# EAGLE design microNode (EAGLE 9.1.2)
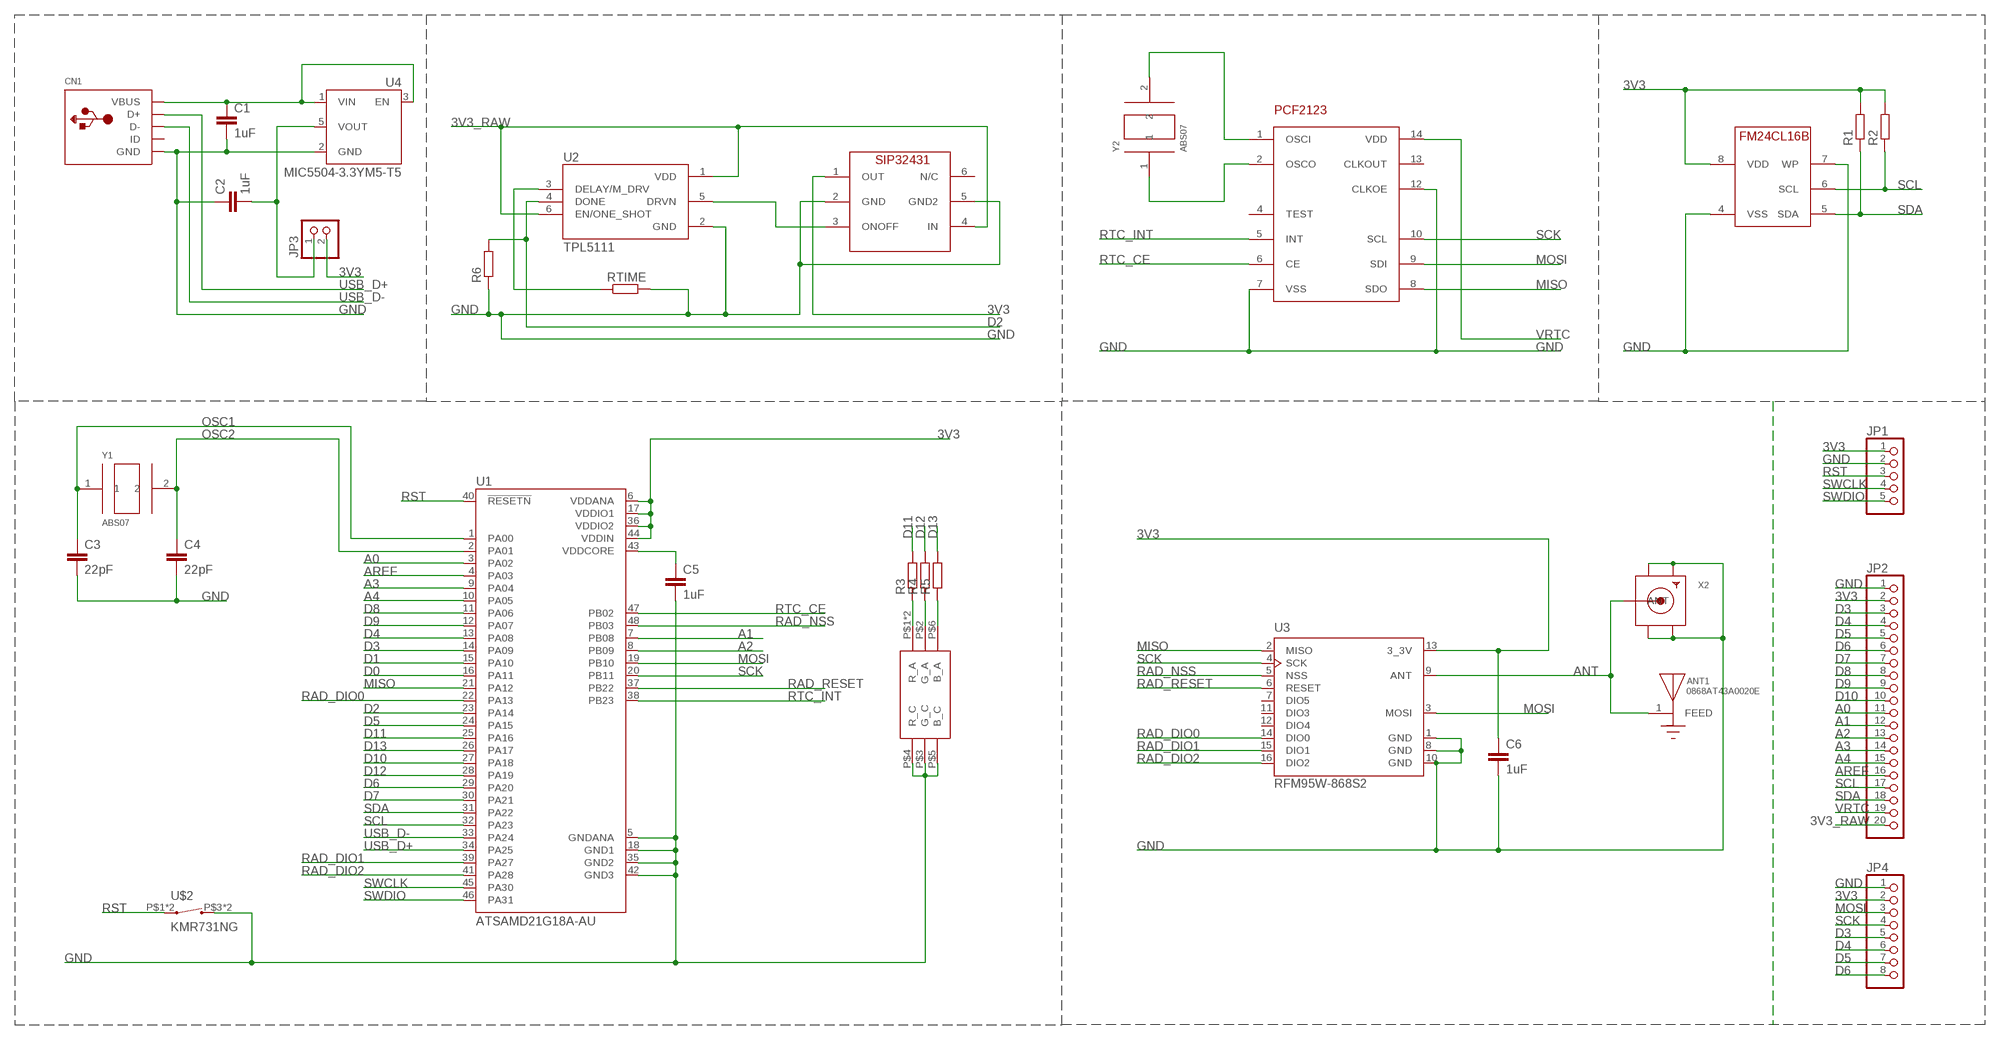
[diagram p0: schematic, sheet 1]

## Parts
ANT1  0868AT43A0020E  [XCVR_0868AT43A0020E]
C1  1uF  CC1206  [C1206]
C2  1uF  CC1206  [C1206]
C3  22pF  CC0603  [C0603]
C4  22pF  CC0603  [C0603]
C5  1uF  CC1206  [C1206]
C6  1uF  CC1206  [C1206]
CN1  USBMINIB  [USB-MINIB]
JP1  PINHD-1X5  [1X05]
JP2  PINHD-1X20  [1X20]
JP3  PINHD-1X2  [1X02]
JP4  PINHD-1X8  [1X08]
R1  RR0603  [R0603]
R2  RR0603  [R0603]
R3  RR0603  [R0603]
R4  RR0603  [R0603]
R5  RR0603  [R0603]
R6  RR0603  [R0603]
RTIME  RR1206  [R1206]
U1  ATSAMD21G18A-AU  [QFP50P900X900X120-48N]
U2  TPL5111  [SOT95P280X110-6N]
U3  RFM95W-868S2  [XCVR_RFM95W-868S2]
U4  MIC5504-3.3YM5-T5  [SOT23-5P95_280X145XL45X37N]
U5  FM24CL16B  [SOIC-8]
U7  SIP32431DR3  [SC-70-6]
U8  PCF2123  [TSSOP14]
U$1  MSL0104RGB  [MSL0104RGB]
U$2  KMR731NG  [KMR731NG]
X2  SMACONNECTOR  [SMA90_DIP]
Y1  ABS07  [XTAL320X150X90]
Y2  ABS07  [XTAL320X150X90]

## Nets
3V3: C6.1 JP1.1 JP2.2 JP3.2 JP4.2 R1.2 R2.2 U1.6(VDDANA) U1.17(VDDIO1) U1.36(VDDIO2) U1.44(VDDIN) U3.13(3_3V) U5.8(VDD) U7.1(OUT)
3V3_RAW: JP2.20 U2.1(VDD) U2.6(EN/ONE_SHOT) U7.4(IN)
A0: JP2.11 U1.3(PA02)
A1: JP2.12 U1.7(PB08)
A2: JP2.13 U1.8(PB09)
A3: JP2.14 U1.9(PA04)
A4: JP2.15 U1.10(PA05)
ANT: ANT1.1(FEED) U3.9(ANT) X2.ANTENNA(ANT)
AREF: JP2.16 U1.4(PA03)
D0: U1.16(PA11)
D1: U1.15(PA10)
D2: R6.2 U1.23(PA14) U2.4(DONE)
D3: JP2.3 JP4.5 U1.14(PA09)
D4: JP2.4 JP4.6 U1.13(PA08)
D5: JP2.5 JP4.7 U1.24(PA15)
D6: JP2.6 JP4.8 U1.29(PA20)
D7: JP2.7 U1.30(PA21)
D8: JP2.8 U1.11(PA06)
D9: JP2.9 U1.12(PA07)
D10: JP2.10 U1.27(PA18)
D11: R3.2 U1.25(PA16)
D12: R4.2 U1.28(PA19)
D13: R5.2 U1.26(PA17)
GND: C1.2 C2.1 C3.2 C4.2 C5.2 C6.2 CN1.GND JP1.2 JP2.1 JP4.1 R6.1 RTIME.2 U1.5(GNDANA) U1.18(GND1) U1.35(GND2) U1.42(GND3) U2.2(GND) U3.1(GND) U3.8(GND) U3.10(GND) U4.2(GND) U5.4(VSS) U5.7(WP) U7.2(GND) U7.5(GND2) U8.7(VSS) U8.12(CLKOE) U$1.P$3(G_C) U$1.P$4(R_C) U$1.P$5(B_C) U$2.P$3 U$2.P$4 X2.GND1 X2.GND2 X2.GND3 X2.GND4
MISO: U1.21(PA12) U3.2(MISO) U8.8(SDO)
MOSI: JP4.3 U1.19(PB10) U3.3(MOSI) U8.9(SDI)
N$1: RTIME.1 U2.3(DELAY/M_DRV)
N$2: U2.5(DRVN) U7.3(ONOFF)
N$3: C1.1 CN1.VBUS U4.1(VIN) U4.3(EN)
N$4: U8.1(OSCI) Y2.2
N$5: U8.2(OSCO) Y2.1
N$6: C2.2 JP3.1 U4.5(VOUT)
N$8: C5.1 U1.43(VDDCORE)
N$12: R3.1 U$1.P$1(R_A) U$1.P$7(R_A)
N$13: R4.1 U$1.P$2(G_A)
N$14: R5.1 U$1.P$6(B_A)
OSC1: C3.1 U1.1(PA00) Y1.1
OSC2: C4.1 U1.2(PA01) Y1.2
RAD_DIO0: U1.22(PA13) U3.14(DIO0)
RAD_DIO1: U1.39(PA27) U3.15(DIO1)
RAD_DIO2: U1.41(PA28) U3.16(DIO2)
RAD_NSS: U1.48(PB03) U3.5(NSS)
RAD_RESET: U1.37(PB22) U3.6(RESET)
RST: JP1.3 U1.40(!RESETN) U$2.P$1 U$2.P$2
RTC_CE: U1.47(PB02) U8.6(CE)
RTC_INT: U1.38(PB23) U8.5(INT)
SCK: JP4.4 U1.20(PB11) U3.4(SCK) U8.10(SCL)
SCL: JP2.17 R2.1 U1.32(PA23) U5.6(SCL)
SDA: JP2.18 R1.1 U1.31(PA22) U5.5(SDA)
SWCLK: JP1.4 U1.45(PA30)
SWDIO: JP1.5 U1.46(PA31)
USB_D+: CN1.D+ U1.34(PA25)
USB_D-: CN1.D- U1.33(PA24)
VRTC: JP2.19 U8.14(VDD)
Unconnected: CN1.ID U3.7(DIO5) U3.11(DIO3) U3.12(DIO4) U7.6(N/C) U8.4(TEST) U8.13(CLKOUT)

## Library data of the parts
ANT1 = 0868AT43A0020E:0868AT43A0020E: Antenna 868mhz For Ti Cc11xx; AVAILABILITY: Good; DESCRIPTION: Antenna 868mhz For Ti Cc11xx; MF: Johanson; MP: 0868AT43A0020E; PACKAGE: None; PRICE: 0.59 USD
C1-C6 = eagle-ltspice:C: CAPACITOR, European symbol; SPICEMODEL: NONE; SPICEPREFIX: C
CN1 = adafruit:USB: USB Connectors USBMINIB - Surface Mount Female Mini-B USB Connector 4UConnector: 06564 By microbuilder.eu Thru-hole RA Female Mini-B USB Connector 4UConnector: 18732 By ladyada.net
JP1 = pinhead:PINHD-1X5: PIN HEADER
JP2 = pinhead:PINHD-1X20: PIN HEADER
JP3 = pinhead:PINHD-1X2: PIN HEADER
JP4 = pinhead:PINHD-1X8: PIN HEADER
R1-R6 RTIME = eagle-ltspice:R: RESISTOR, European symbol; SPICEMODEL: NONE; SPICEPREFIX: R
U1 = ATSAMD21G18A-AU:ATSAMD21G18A-AU: Cortex-M0+, 256KB FLASH, 32KB SRAM, USB, DMA, T&R - 48TQFP IND TEMP, GREEN, 1.6-3.6V, 48MHz; AVAILABILITY: Good; DESCRIPTION: SAMD21G Series 256 kB Flash 32 kB SRAM 48 MHz 32-Bit Microcontroller - TQFP-48; MF: Microchip; MP: ATSAMD21G18A-AU; PACKAGE: TQFP-48 Microchip; PRICE: 3.06 USD
U2 = TPL5111DDCR:TPL5111: Ultra Low Power System Timer (35 nA) for Power Gating in duty cycled applications 6-SOT -40 to 105; AVAILABILITY: Good; DESCRIPTION: Ultra Low Power System Timer _35 nA_ for Power Gating in duty cycled applications 6-SOT -40 to 105; MF: Texas Instruments; MP: TPL5111DDCR; PACKAGE: SOT-23 Texas Instruments; PRICE: 0.50 USD
U3 = RFM95W-868S2:RFM95W-868S2: Mod Txrx Lora +20dbm 868mhz Smd; AVAILABILITY: Bad; DESCRIPTION: Mod Txrx Lora +20dbm 868mhz Smd; MF: RF Solutions; MP: RFM95W-868S2; PACKAGE: None; PRICE: 22.89 USD
U4 = MIC5504-3.3YM5-T5:MIC5504-3.3YM5-T5: Single 300mA LDO with Enable Pull-Down & Auto Discharge, 5 SOT-23 T/R; AVAILABILITY: Good; DESCRIPTION: Single 300mA LDO with Enable Pull-Down & Auto Discharge, 5 SOT-23 T/R; MF: Microchip; MP: MIC5504-3.3YM5-T5; PACKAGE: SOT-23-5 Microchip; PRICE: 0.13 USD
U5 = FM24CL16B:FM24CL16B
U7 = SIP32431DR3T1GE3:SIP32431DR3: Ultra Low Leakage and Quiescent Current, 1 A Load Switch with Reverse Blocking
U8 = PCF2123TS:PCF2123
U$1 = MSL0104RGB:MSL0104RGB
U$2 = button:KMR731NG
X2 = adafruit:SMACONNECTOR: SMA Connector 90° DIP SMA Connector, 50 Ohm (4UConnector: 07259)
Y1 Y2 = ABS07-120-32.768KHZ-T:ABS07: ABS07 Series 32.768 kHz ±20 ppm 12.5 pF -40 to +85 C SMT Low Profile Crystal; AVAILABILITY: Good; DESCRIPTION: 3.2 x 1.5mm, 32.768KHZ Xtal 6pf, 20ppm, -40+85C, ESR 60kOhm, ST Micro Ref Design Crystal for STM32L; MF: Abracon; MP: ABS07-120-32.768KHZ-T; PACKAGE: SMD-2 Abracon; PRICE: 0.41 USD

## Board
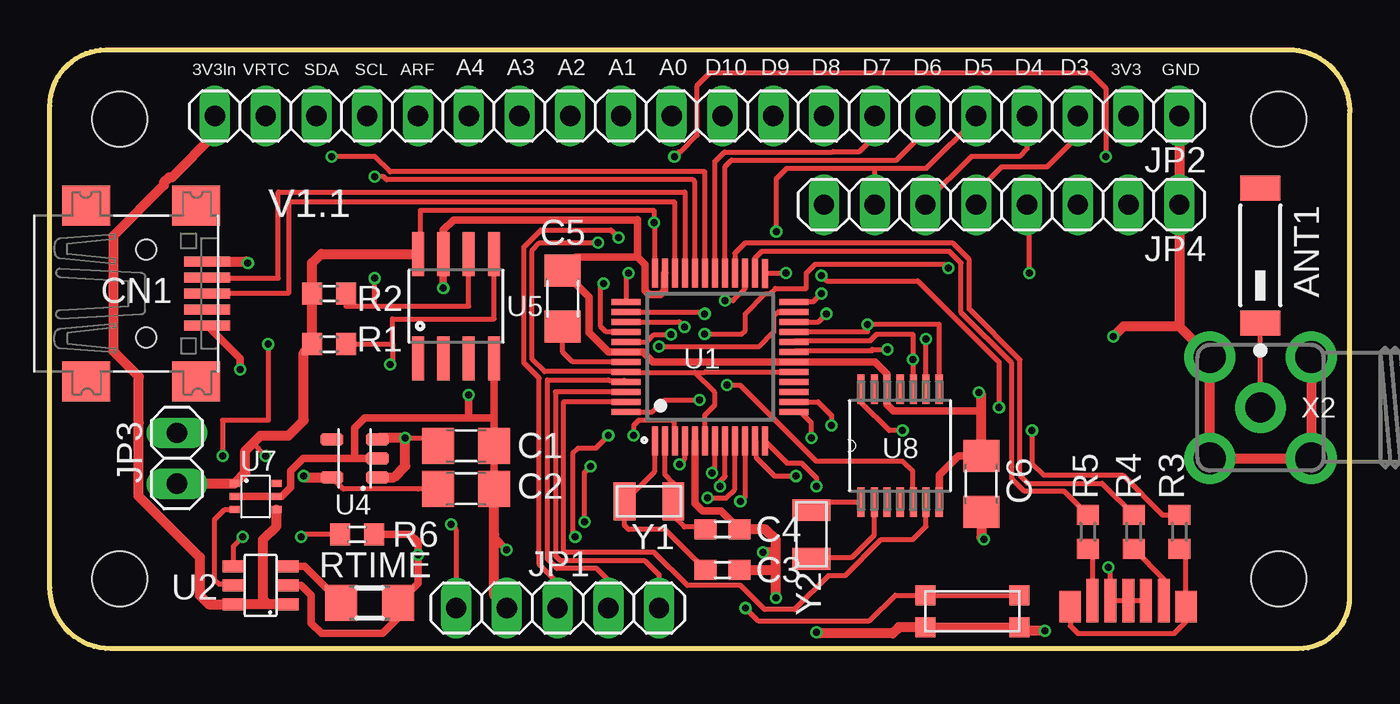
[diagram p1: board, top side]
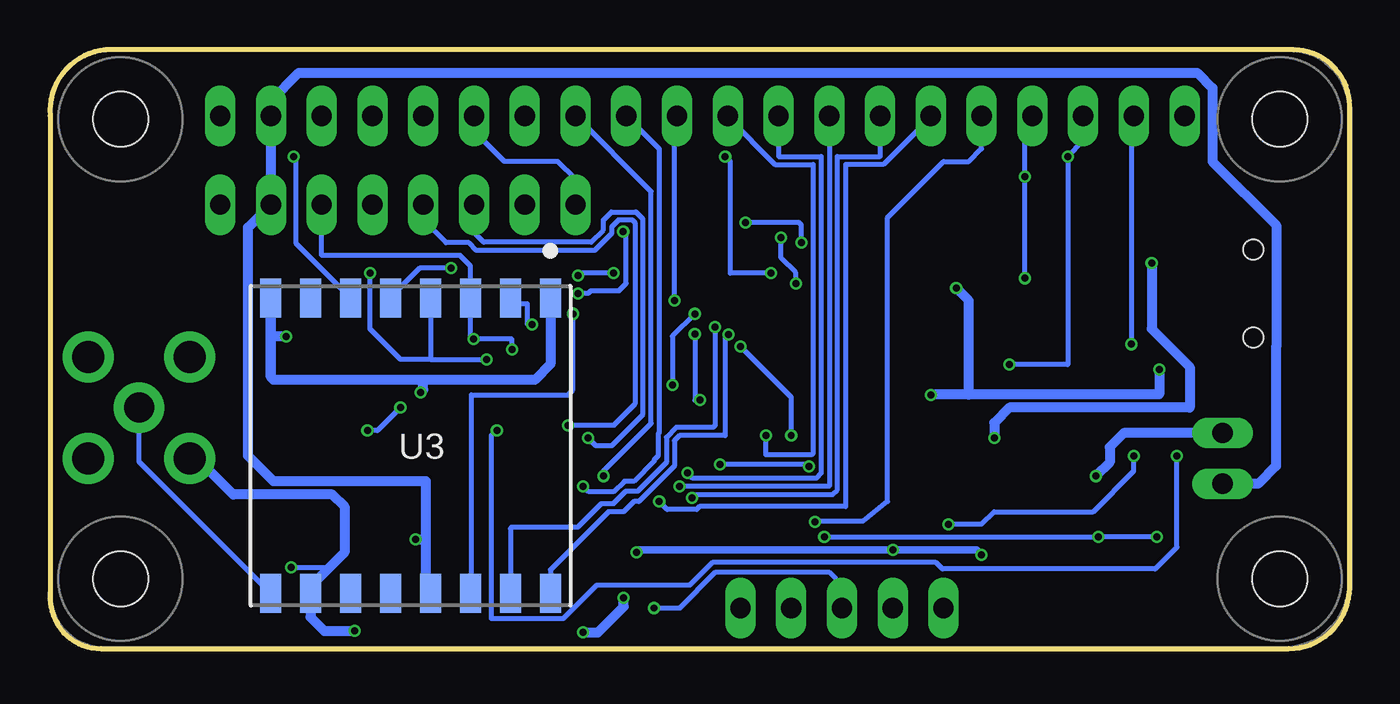
[diagram p2: board, bottom side, seen from below]

Size 65.03 x 29.97 mm. Coordinates in mm from the lower left corner, seen from the top.
Outline: 0,27.18 arc-90 2.79,29.97 62.23,29.97 arc-90 65.02,26.67 65.02,2.54 arc-90 62.48,0 3.05,0 arc-90 0,3.05 0,27.18
Copper layers (1*16): Top 0.035559375mm / dielectric 1.6mm / Bottom 0.035559375mm
Design rules "oshpark-2layer": minimum track width 6mil, minimum drill 10mil, track to track 6mil, track to pad 6mil, pad to pad 6mil, via to via 6mil, smd to smd 6mil, copper to edge 15mil, drill to drill 6mil, minimum pad ring 5mil, minimum via ring 5mil, stop-mask expansion 2.5mil, vias tented up to drill 0mil, thermal gap 10mil
Holes 2.75 mm at 3.5,3.5 3.5,26.5 61.5,3.5 61.5,26.5

### Footprints (pad centres in the part's own frame; a part is rotated, then mirrored left to right if it is on the bottom)
XCVR_0868AT43A0020E = smd 1.25 x 2: 1 -3.375,0; 2 3.375,0
C1206 = smd 1.6 x 1.8: 1 -1.4,0; 2 1.4,0
C0603 = smd 1.1 x 1: 1 -0.85,0; 2 0.85,0
USB-MINIB = smd 0.5 x 2.308: D+ 0,4.064; D- -0.8,4.064; GND 1.6,4.064; ID 0.8,4.064; VBUS -1.6,4.064 | smd 2 x 2.4: GND1 -4.4,-2; GND2 -4.4,3.5; GND3 4.4,3.5; GND4 4.4,-2 | hole 1: -2.2,1; 2.2,1
1X05 = drill 1.016 long: 1 -5.08,0; 2 -2.54,0; 3 0,0; 4 2.54,0; 5 5.08,0
1X20 = drill 1.016 long: 1 -24.13,0; 2 -21.59,0; 3 -19.05,0; 4 -16.51,0; 5 -13.97,0; 6 -11.43,0; 7 -8.89,0; 8 -6.35,0; 9 -3.81,0; 10 -1.27,0; 11 1.27,0; 12 3.81,0; 13 6.35,0; 14 8.89,0; 15 11.43,0; 16 13.97,0; 17 16.51,0; 18 19.05,0; 19 21.59,0; 20 24.13,0
1X02 = drill 1.016 long: 1 -1.27,0; 2 1.27,0
1X08 = drill 1.016 long: 1 -8.89,0; 2 -6.35,0; 3 -3.81,0; 4 -1.27,0; 5 1.27,0; 6 3.81,0; 7 6.35,0; 8 8.89,0
R0603 = smd 1 x 1.1: 1 -0.85,0; 2 0.85,0
R1206 = smd 1.6 x 1.803: 1 -1.422,0; 2 1.422,0
QFP50P900X900X120-48N = smd 1.45 x 0.3: 1 -4.2,2.75; 2 -4.2,2.25; 3 -4.2,1.75; 4 -4.2,1.25; 5 -4.2,0.75; 6 -4.2,0.25; 7 -4.2,-0.25; 8 -4.2,-0.75; 9 -4.2,-1.25; 10 -4.2,-1.75; 11 -4.2,-2.25; 12 -4.2,-2.75; 25 4.17,-2.75; 26 4.2,-2.25; 27 4.2,-1.75; 28 4.2,-1.25; 29 4.2,-0.75; 30 4.2,-0.25; 31 4.2,0.25; 32 4.2,0.75; 33 4.2,1.25; 34 4.2,1.75; 35 4.2,2.25; 36 4.2,2.75 | smd 0.3 x 1.45: 13 -2.75,-4.2; 14 -2.25,-4.2; 15 -1.75,-4.2; 16 -1.25,-4.2; 17 -0.75,-4.2; 18 -0.25,-4.2; 19 0.25,-4.2; 20 0.75,-4.2; 21 1.25,-4.2; 22 1.75,-4.2; 23 2.25,-4.2; 24 2.75,-4.2; 37 2.75,4.2; 38 2.25,4.2; 39 1.75,4.2; 40 1.25,4.2; 41 0.75,4.2; 42 0.25,4.2; 43 -0.25,4.2; 44 -0.75,4.2; 45 -1.25,4.2; 46 -1.75,4.2; 47 -2.25,4.2; 48 -2.75,4.2
SOT95P280X110-6N = smd 1.1 x 0.6: 1 -1.35,0.95; 2 -1.35,0; 3 -1.35,-0.95; 4 1.35,-0.95; 5 1.35,0; 6 1.35,0.95
XCVR_RFM95W-868S2 = smd 1.95 x 1.05: 1 -7.4,7; 2 -7.4,5; 3 -7.4,3; 4 -7.4,1; 5 -7.4,-1; 6 -7.4,-3; 7 -7.4,-5; 8 -7.4,-7; 9 7.4,-7; 10 7.4,-5; 11 7.4,-3; 12 7.4,-1; 13 7.4,1; 14 7.4,3; 15 7.4,5; 16 7.4,7
SOT23-5P95_280X145XL45X37N = smd 1.14 x 0.6: 1 -1.14,0.95; 2 -1.14,0; 3 -1.14,-0.95; 4 1.14,-0.95; 5 1.14,0.95
SOIC-8 = smd 0.61 x 2.21: 1 -1.905,-2.616; 2 -0.635,-2.616; 3 0.635,-2.616; 4 1.905,-2.616; 5 1.905,2.616; 6 0.635,2.616; 7 -0.635,2.616; 8 -1.905,2.616
SC-70-6 = smd 0.35 x 0.5: 1 -0.65,-1.05; 2 0,-1.05; 3 0.65,-1.05; 4 0.65,1.05; 5 0,1.05; 6 -0.65,1.05
TSSOP14 = smd 1.473 x 0.356: 1 -2.819,1.956; 2 -2.819,1.295; 3 -2.819,0.66; 4 -2.819,0; 5 -2.819,-0.66; 6 -2.819,-1.295; 7 -2.819,-1.956; 8 2.819,-1.956; 9 2.819,-1.295; 10 2.819,-0.66; 11 2.819,0; 12 2.819,0.66; 13 2.819,1.295; 14 2.819,1.956
MSL0104RGB = smd 1.06 x 1.58: P$1 -6.18,0.046; P$7 -0.38,0.046 | smd 0.6 x 2.18: P$2 -5.08,-0.254; P$3 -4.18,-0.254; P$4 -3.28,-0.254; P$5 -2.38,-0.254; P$6 -1.48,-0.254
KMR731NG = smd 1 x 1: P$1 0.5,-0.5; P$2 5.2,-0.5; P$3 5.2,-2.1; P$4 0.5,-2.1
SMA90_DIP = drill 1.5 pad 2.54: ANTENNA 0,0 | drill 1.6 pad 2.54: GND1 -2.54,2.54; GND2 2.54,2.54; GND3 -2.54,-2.54; GND4 2.54,-2.54
XTAL320X150X90 = smd 1.092 x 1.905: 1 -1.219,0; 2 1.219,0

### Placement (x,y rotation side)
ANT1  60.58,19.68 90 top
C1  20.83,10.16 0 top
C2  20.83,8 180 top
C3  33.66,3.94 0 top
C4  33.66,5.97 0 top
C5  25.65,17.53 90 top
C6  46.61,8.25 90 top
CN1  3.81,17.78 270 top
JP1  25.4,2.03 0 top
JP2  32.38,26.67 180 top
JP3  6.35,9.52 270 top
JP4  47.63,22.22 180 top
R1  13.97,15.24 180 top
R2  13.97,17.78 180 top
R3  56.52,5.84 90 top
R4  54.23,5.84 90 top
R5  51.94,5.84 90 top
R6  15.37,5.71 180 top
RTIME  16,2.29 0 top
U1  33.02,14.6 90 top
U2  10.54,3.17 180 top
U3  46.99,10.16 270 bottom
U4  15.24,9.52 180 top
U5  20.32,17.14 0 top
U7  10.29,7.62 270 top
U8  42.55,10.16 90 top
U$1  50.67,2.16 180 top
U$2  43.31,3.17 0 top
X2  60.58,12.06 270 top
Y1  29.97,7.37 0 top
Y2  38.1,5.71 90 top

### Tracks (layer width: path | path; a pad name or v marks a point on that pad's centre or on a via)
3V3  (via drill 0.35)
  Top 0.254: 32.26,13.83 28.84,13.83 U1.44 28.13,13.85 28.11,13.87 24.74,13.87 24.13,14.48 24.13,19.94 24.51,20.32 v27.43,20.32 | 32.26,13.83 32.77,13.83 32.79,13.85 U1.17 | U5.8 18.54,19.89 18.54,21.95 30.23,21.95 v30.23,21.34 30.27,21.29 U1.36 | U1.6 32.77,11.69 33.27,12.19 33.27,12.82 32.26,13.83 | v20.07,6.22 20.32,5.97 JP1.1 | v10.8,9.65 10.16,10.29
  Top 0.508: U5.8 13.58,19.76 13.12,19.3 R2.2 R1.2 12.7,14.82 12.7,11.43 11.94,10.67 10.54,10.67 10.16,10.29 9.78,9.91 9.78,8.81 U7.1 6.37,8.27 JP3.2 | C6.1 46.61,5.59 v46.74,5.46
  Bottom 0.254: v27.43,20.32 27.43,21.21 27.56,21.34 v30.23,21.34 | v20.07,6.22 18.41,6.22 17.78,6.86 12.83,6.86 10.8,8.89 v10.8,9.65
  Bottom 0.508: U3.13 45.97,2.78 46.23,3.03 46.23,5.59 | 46.23,5.59 46.23,8.38 53.85,8.38 55.12,9.65 55.12,21.08 JP4.2 JP2.2 53.98,27.43 52.58,28.83 7.62,28.83 6.86,28.07 6.86,24.38 3.68,21.2 3.68,15.11 3.68,15.1 3.68,9.14 4.57,8.25 JP3.2 | v46.74,5.46 46.35,5.46 46.23,5.59
3V3_RAW
  Top 0.254: 4.45,13.62 4.45,13.59 | 3.17,20.66 3.17,20.57
  Top 0.508: JP2.20 8.26,25.75 6.09,23.59 5.94,23.59 5.7,23.35 5.7,23.2 3.17,20.66 | 3.17,20.57 3.17,14.9 4.45,13.62 | 4.45,13.59 4.45,11.3 4.42,11.28 4.42,7.64 7.49,4.57 7.49,2.67 7.94,2.22 U2.6 10.92,2.22 | U2.1 10.92,2.22 | 10.92,2.22 10.67,2.48 10.67,5.46 11.34,6.13 U7.4
A0  (via drill 0.35)
  Top 0.254: U1.3 31.24,10.43 31.24,11.3 31.12,11.43 29.66,11.43 29.46,11.43 29.21,11.18 v29.21,10.67
  Bottom 0.254: JP2.11 31.12,26.6 28.74,24.23 26.85,24.23 26.85,9.78 26.92,9.7 29.21,9.7 v29.21,10.67
A1  (via drill 0.35)
  Top 0.254: v33.12,8.79 33.27,8.94 U1.7
  Bottom 0.254: JP2.12 28.57,24.64 26.44,24.64 26.44,8.79 26.7,8.53 32.87,8.53 v33.12,8.79
A2  (via drill 0.35)
  Top 0.254: v33.53,8.13 33.53,8.38 33.78,8.63 33.78,10.39 U1.8
  Bottom 0.254: JP2.13 26.04,8.13 v33.53,8.13
A3  (via drill 0.35)
  Top 0.254: v32.91,7.55 33.84,7.55 34.27,7.98 U1.9
  Bottom 0.254: JP2.14 23.49,24.64 25.63,24.64 25.63,7.96 25.87,7.72 32.74,7.72 v32.91,7.55
A4  (via drill 0.35)
  Top 0.254: 34.8,10.38 U1.10 34.8,10.38 | v34.54,7.37 34.8,7.62 34.8,10.38
  Bottom 0.254: JP2.15 20.96,26.6 23.33,24.23 25.22,24.23 25.22,7.11 32.53,7.11 32.67,6.96 34.14,6.96 v34.54,7.37
ANT
  Top 0.254: X2.ANTENNA ANT1.1
  Bottom 0.254: U3.9 60.58,9.35 X2.ANTENNA
AREF  (via drill 0.35)
  Top 0.254: v26.74,6.35 26.74,8.81 v27.05,9.12 | v31.5,9.23 31.77,9.5 U1.4
  Bottom 0.254: JP2.16 18.41,25.02 19.05,24.38 20.32,24.38 23.11,21.59 23.11,7.37 24.36,6.38 26.72,6.38 v26.74,6.35 | v31.5,9.23 27.16,9.23 v27.05,9.12
D2  (via drill 0.35)
  Top 0.254: v30.48,15.14 35.5,15.14 36.22,15.85 36.22,16.62 36.45,16.85 U1.23 | R6.2 12.7,5.71 v12.57,5.59 | v27.94,10.67 27.3,10.03 26.42,10.03 26.16,9.78 26.16,5.71 v26.29,5.59 | U2.4 9.19,5.13 v9.65,5.59
  Bottom 0.254: v30.48,15.14 27.94,12.6 v27.94,10.67 | v26.29,5.59 v12.57,5.59 v9.65,5.59
D3  (via drill 0.35)
  Top 0.254: U1.14 38.45,12.35 39.12,11.68 v39.12,11.18 | JP4.5 46.35,22.86 47.63,24.13 49.91,24.13 51.43,25.65 JP2.3
  Bottom 0.254: v39.12,11.18 36.83,11.18 35.76,12.24 35.76,21.34 35.88,21.45 36.59,21.45 36.93,21.11 36.93,20.79 37.78,19.94 43.69,19.94 44.07,20.32 45.21,20.32 46.35,21.46 JP4.5
D4  (via drill 0.35)
  Top 0.254: JP2.4 48.9,25.02 48.51,24.64 46.1,24.64 43.82,22.35 JP4.6 | v38.1,10.54 38.1,11.3 37.55,11.85 U1.13
  Bottom 0.254: JP4.6 43.82,20.83 43.33,20.34 37.95,20.34 37.34,20.95 37.34,21.46 36.94,21.86 35.71,21.86 35.36,21.5 35.36,11.73 36.93,10.16 37.72,10.16 v38.1,10.54
D5  (via drill 0.35)
  Top 0.254: U1.24 38.18,17.35 v38.61,17.78 | JP2.5 46.35,26.54 43.87,24.05 41.27,24.05 | 41.27,24.05 36.88,24.05 36.35,23.52 v36.35,20.87 | JP4.7 41.27,24.05
  Bottom 0.254: v38.61,17.78 38.1,17.78 37.97,17.91 36.58,17.91 36.2,18.29 36.2,20.72 v36.35,20.87
D6
  Top 0.254: U1.29 33.78,18.8 33.78,24.13 34.11,24.46 42.37,24.46 43.82,25.91 JP2.6
  Bottom 0.254: JP2.6 43.82,25.91 42.29,24.38 39.62,24.38 38.74,23.49 JP4.8
D7
  Top 0.254: U1.30 33.27,23.62 33.27,23.63 33.27,24.38 33.76,24.87 39.17,24.87 39.19,24.89 40.51,24.89 41.27,25.65 JP2.7
D8  (via drill 0.35)
  Top 0.254: U1.11 35.34,10.33 35.34,9.56 36.27,8.64 v37.34,8.64
  Bottom 0.254: JP2.8 34.95,22.88 34.95,11.28 37.34,8.89 v37.34,8.64
D9  (via drill 0.35)
  Top 0.254: U1.12 36.88,9.29 37.61,9.29 38.35,8.55 v38.35,8.13
  Bottom 0.254: JP2.9 34.54,25.02 34.54,10.8 34.6,10.75 34.6,9.65 34.8,9.45 34.8,9.4 35.81,8.38 36.29,8.38 36.8,7.87 38.1,7.87 v38.35,8.13
D10  (via drill 0.35)
  Top 0.254: U1.27 34.77,18.01 34.19,17.42 v33.78,17.42
  Bottom 0.254: v33.78,17.42 33.78,26.54 JP2.10
D11  (via drill 0.35)
  Top 0.254: U1.25 35.77,18.8 v36.83,18.8 | v38.61,18.67 38.86,18.41 43.43,18.41 47.5,14.35 v47.5,12.06 | v49.15,10.92 49.15,9.27 49.73,8.69 53.68,8.69 55.67,6.69 R3.2
  Bottom 0.254: v36.83,18.8 38.48,18.8 v38.61,18.67 | v47.5,12.06 48.64,10.92 v49.15,10.92
D12
  Top 0.254: R4.2 52.64,8.28 48.94,8.28 48.54,8.68 48.54,14.46 46,17 46,19.47 45.18,20.29 34.77,20.29 34.27,19.79 U1.28
D13
  Top 0.254: R5.2 50.76,7.87 48.77,7.87 48.13,8.51 48.13,14.29 45.59,16.83 45.59,19.3 45.01,19.88 35.61,19.88 35.27,19.54 U1.26
GND  (via drill 0.35)
  Top 0.254: U$1.P$3 U$1.P$4 U$1.P$5 53.05,3.97 v52.96,4.06
  Top 0.381: U7.2 U7.5 11.6,7.62 12.05,8.08 12.05,8.9 12.68,9.52 15.24,9.52 | 15.24,9.52 U4.2 | 15.24,9.52 15.24,11.05 15.75,11.56 20.96,11.56 | 20.96,11.56 v20.96,12.7 | 20.96,11.56 22.23,11.56 | 22.23,11.56 U5.4 | 22.23,11.56 C1.2 C2.1 | 29.41,19.6 29.41,21.47 29.4,21.46 20.19,21.46 19.68,20.95 U5.7 v19.68,18.06 | 29.41,19.6 29.78,19.23 29.78,17.94 29.98,17.74 30.56,17.74 30.76,17.94 30.76,18.8 U1.35 | U1.5 32.27,7.28 32.65,6.9 33.57,6.9 C4.2 | v9.52,13.97 9.52,14.53 CN1.GND | 29.41,19.6 26.33,19.6 C5.2 26.99,17.59 26.99,15.83 27.95,14.86 28.81,14.86 U1.42 29.69,14.85 30.18,14.35 U1.18 41.27,14.35 41.88,13.74 U8.12 41.88,12.22 42.2,11.9 46.52,11.9 46.61,11.81 | U2.2 12.57,3.17 13.08,2.67 13.08,1.27 13.59,0.76 16.64,0.76 17.42,1.55 RTIME.2 18.41,3.28 v18.41,4.7 18.41,5.33 18.03,5.71 R6.1 | U8.7 44.5,8.69 45.47,9.66 C6.2 | v22.86,4.95 22.23,5.59 22.23,5.71
  Top 0.508: C6.2 46.61,11.81 46.61,12.7 v46.48,12.83 | X2.GND1 X2.GND2 X2.GND4 X2.GND3 56.52,16.13 | JP2.1 JP4.1 56.52,16.13 | 56.52,16.13 53.72,16.13 v53.21,15.62 | v36.32,2.54 36.32,3.94 | 22.48,2.41 JP1.2 22.23,2.66 22.23,5.71 C2.1 | C3.2 36.32,3.94 | C4.2 35.81,5.97 36.32,5.46 36.32,4.83 | 36.32,3.94 36.32,4.83 | 36.32,4.83 v35.69,4.83 | v38.35,0.81 38.4,0.76 42.16,0.76 42.48,1.07 U$2.P$4 U$2.P$3 48.69,0.89 v49.78,0.89
  Bottom 0.254: 19.05,12.7 v20.96,12.7 | 53.85,13.46 53.85,17.56 U3.8 | v52.96,4.06 51.05,4.06 50.8,4.32
  Bottom 0.381: v35.69,4.83 35.56,4.95 26.57,4.95 26.56,4.94 26.02,4.94 26.01,4.95 v22.86,4.95 18.67,4.95 v18.41,4.7
  Bottom 0.508: U3.1 39.99,14.24 40.77,13.46 46.35,13.46 | 46.35,13.46 53.85,13.46 53.99,13.6 53.99,15.62 | 53.99,15.62 U3.8 | v9.52,13.97 9.52,12.72 20.93,12.72 v20.96,12.7 | 19.05,12.7 19.05,17.42 v19.68,18.06 | v46.48,12.83 46.35,12.95 46.35,13.46 | X2.GND4 57.66,9.52 55.85,7.72 50.9,7.72 50.29,7.11 50.29,4.83 50.8,4.32 51.99,3.13 | v53.21,15.62 53.99,15.62 | v36.32,2.54 36.32,2.1 37.62,0.81 v38.35,0.81 | v49.78,0.89 51.31,0.89 51.99,1.57 U3.10
MISO  (via drill 0.35)
  Top 0.254: U1.21 40.91,15.85 v40.91,16.23 44.5,16.23 U8.8
  Bottom 0.254: U3.2 41.99,17.27 41.15,17.27 41.15,16.23 v40.91,16.23
MOSI  (via drill 0.35)
  Top 0.254: U1.19 37.29,14.93 41.13,14.93 41.13,14.99 v41.91,14.99 | U8.9 v43.84,15.49
  Bottom 0.254: v41.91,14.99 41.91,15.49 v43.84,15.49 43.99,15.49 U3.3 43.99,19.16 44.51,19.68 51.43,19.68 JP4.3
N$1
  Top 0.381: RTIME.1 12.74,4.12 U2.3
N$2
  Top 0.254: U2.5 9.24,3.22 8.46,3.22 8.26,3.43 8.26,6.48 8.75,6.97 U7.3
N$3  (via drill 0.35)
  Top 0.254: v17.78,10.54 19.05,10.54 C1.1
  Top 0.508: CN1.VBUS 9.83,19.38 v9.91,19.3 | U4.3 16.45,10.54 v17.78,10.54 17.78,9.14 17.21,8.57 U4.1
  Bottom 0.508: v9.91,19.3 9.91,16 8,14.1 8,12.06 17.02,12.06 17.78,11.3 v17.78,10.54
N$4
  Top 0.254: Y2.2 38.51,7.34 U8.1
N$5
  Top 0.254: Y2.1 38.18,4.57 40.13,4.57 41.25,5.69 U8.2
N$6  (via drill 0.35)
  Top 0.254: C2.2 19.18,8 18.41,8 14.68,8 U4.5
  Top 0.508: v12.7,8.64 12.76,8.57 U4.5
  Bottom 0.254: 11.88,10.22 11.94,10.16
  Bottom 0.508: JP3.1 11.3,10.79 11.88,10.22 | 11.94,10.16 12,10.1 12,9.34 v12.7,8.64
N$8
  Top 0.254: C5.1 25.65,14.86 26.16,14.35 U1.43
N$12
  Top 0.254: R3.1 56.85,4.65 U$1.P$1 56.85,1.35 56.26,0.76 51.43,0.76 51.05,1.14 U$1.P$7
N$13
  Top 0.254: R4.1 55.75,3.47 U$1.P$2
N$14
  Top 0.254: R5.1 52.15,4.78 U$1.P$6
OSC1
  Top 0.254: U1.1 30.27,8.88 Y1.1 28.75,6.17 28.96,5.97 30.77,5.97 C3.1
OSC2
  Top 0.254: U1.2 30.77,8.73 31.19,8.31 Y1.2 31.19,6.66 31.75,6.1 32.68,6.1 C4.1
RAD_DIO0  (via drill 0.35)
  Top 0.254: U1.22 38.45,16.35 v38.86,16.76
  Bottom 0.254: U3.14 43.94,2.81 43.94,12.7 39.12,12.7 38.86,12.95 v38.86,16.76
RAD_DIO1  (via drill 0.35)
  Top 0.254: U1.39 31.5,16.35 v31.75,16.11
  Bottom 0.254: v31.75,16.11 31.75,11.18 31.85,11.07 33.7,11.07 34.19,10.58 34.19,9.31 35.63,7.87 36.22,7.87 36.83,7.26 37.44,7.26 38.61,6.1 41.91,6.1 41.99,6.02 U3.15
RAD_DIO2  (via drill 0.35)
  Top 0.254: U1.41 29.88,15.35 30.24,15.72 v31.07,15.72
  Bottom 0.254: U3.16 39.99,3.95 37.08,6.86 36.32,6.86 35.81,7.37 35.56,7.37 33.78,9.14 33.78,10.41 33.53,10.67 31.24,10.67 31.24,15.54 v31.07,15.72
RAD_NSS  (via drill 0.35)
  Top 0.254: v32.77,15.75 34.61,15.75 34.8,15.93 34.8,16.76 35.8,17.77 36.04,17.77 36.3,18.03 37.85,18.03 37.85,18.8 38.3,19.25 44.76,19.25 v44.96,19.05 | U1.48 30.14,11.85 30.73,12.45 v32.51,12.45
  Bottom 0.254: U3.5 48.01,17.58 46.95,18.63 46.53,19.05 v44.96,19.05 | v32.77,15.75 32.77,12.45 v32.51,12.45
RAD_RESET  (via drill 0.35)
  Top 0.254: v28.96,18.8 28.82,18.66 U1.37 | v31.24,24.64 31.47,24.87 31.55,24.87 32.38,25.7 32.38,28.19 33.02,28.83 52.07,28.83 52.83,28.07 v52.83,24.64
  Bottom 0.254: v28.96,18.8 30.99,18.8 30.99,24.38 v31.24,24.64 | U3.6 52.71,20.27 52.71,24.51 v52.83,24.64
RST  (via drill 0.35)
  Top 0.254: v28.45,20.57 28.07,20.95 24.57,20.95 23.72,20.11 23.72,14.31 24.49,13.55 24.49,4.22 25.4,3.3 JP1.3 | U1.40 27.83,15.85 27.56,16.13 27.56,18.14 v27.71,18.29 | v34.8,2.03 35.43,1.4 41.02,1.4 42.3,2.67 U$2.P$1 U$2.P$2
  Bottom 0.254: v28.45,20.57 28.45,19.56 27.71,18.82 v27.71,18.29 | v34.8,2.03 33.53,2.03 31.73,3.84 26.06,3.84 25.4,3.17 JP1.3
RTC_CE
  Top 0.254: U1.47 25.71,12.35 25.71,4.83 30.23,4.83 31.89,3.16 34.56,3.16 35.76,1.96 37.27,1.96 38.98,3.67 39.8,3.67 41.6,5.46 43.18,5.46 43.84,6.12 U8.6
RTC_INT  (via drill 0.35)
  Top 0.254: U8.5 43.18,7.37 43.18,8.89 42.67,9.4 38.34,9.4 34.54,13.2 v33.89,13.2 | U1.38 32.68,16.85 v32.77,16.76
  Bottom 0.254: v32.77,16.76 33.89,15.64 v33.89,13.2
SCK  (via drill 0.35)
  Top 0.254: U1.20 37.29,15.43 41.06,15.43 41.38,15.75 43.18,15.75 v43.18,14.48 43.18,12.98 U8.10 | v49.02,18.8 49.02,22.1 JP4.4
  Bottom 0.254: 45.97,14.48 45.99,14.48 U3.4 | 45.97,14.48 v43.18,14.48 | 45.97,14.48 47.5,14.48 49.02,16 v49.02,18.8
SCL  (via drill 0.35)
  Top 0.254: R2.1 14.82,17.14 16.26,17.14 | U5.6 20.96,17.14 16.26,17.14 | 16.26,17.14 v16.26,18.54 | U1.32 32.27,23.37 32.17,23.47 16.85,23.47 16.7,23.62 v16.26,23.62
  Bottom 0.254: v16.26,18.54 v16.26,23.62 16.26,26.67 JP2.17
SDA  (via drill 0.35)
  Top 0.254: R1.1 17.15,15.24 | 17.15,15.24 17.15,16.51 22.23,16.51 U5.5 | 17.15,15.24 17.15,14.22 v17.02,14.22 | U1.31 32.77,23.88 17.02,23.88 16.26,24.64 v14.1,24.64
  Bottom 0.254: v17.02,14.22 14.1,14.22 v14.1,24.64 13.34,25.4 JP2.18
SWCLK
  Top 0.254: U1.45 28.75,13.43 27.98,13.43 27.94,13.46 24.89,13.46 24.89,4.49 25.37,4.01 27.36,4.01 27.94,3.43 JP1.4
SWDIO
  Top 0.254: U1.46 25.3,12.85 25.3,4.66 25.54,4.42 29.74,4.42 30.48,3.68 JP1.5
USB_D+
  Top 0.254: U1.34 31.27,22.35 11.94,22.35 11.94,17.78 CN1.D+
USB_D-
  Top 0.254: U1.33 31.77,22.86 11.43,22.86 11.43,18.54 7.87,18.54 CN1.D-
VRTC  (via drill 0.35)
  Top 0.254: v42.67,10.92 42,10.92 40.59,12.33 U8.14 | v10.92,15.24 10.92,11.43 8.64,11.43 v8.64,9.65
  Bottom 0.254: JP2.19 10.92,26.54 v10.92,15.24 | v8.64,9.65 8.64,5.08 9.73,3.99 20.37,3.99 20.7,4.32 31.88,4.32 33.02,3.17 37.68,3.17 39.35,1.51 42.94,1.51 42.94,10.69 v42.67,10.92

### Text on the board
tPlace: 3V3In | VRTC | SDA | SCL | ARF | A4 | A3 | A2 | A1 | A0 | D10 | D9 | D8 | D7 | D6 | D5 | D4 | D3 | 3V3 | GND | V1.1
tNames: U8 | U7